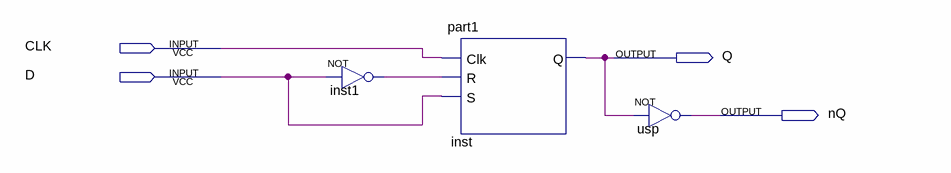
[diagram p0: schematic sheet]
// Quartus schematic part2.bdf as structural Verilog: 3 symbols, 4 pins
module part2 (
  input  CLK,
  input  D,
  output Q,
  output nQ
);

  wire inst1_out;

  not inst1 (inst1_out, D);
  part1 inst (.Clk(CLK), .R(inst1_out), .S(D), .Q(Q));
  not usp (nQ, Q);
endmodule
